# Altium project Funcgen.PrjPcb
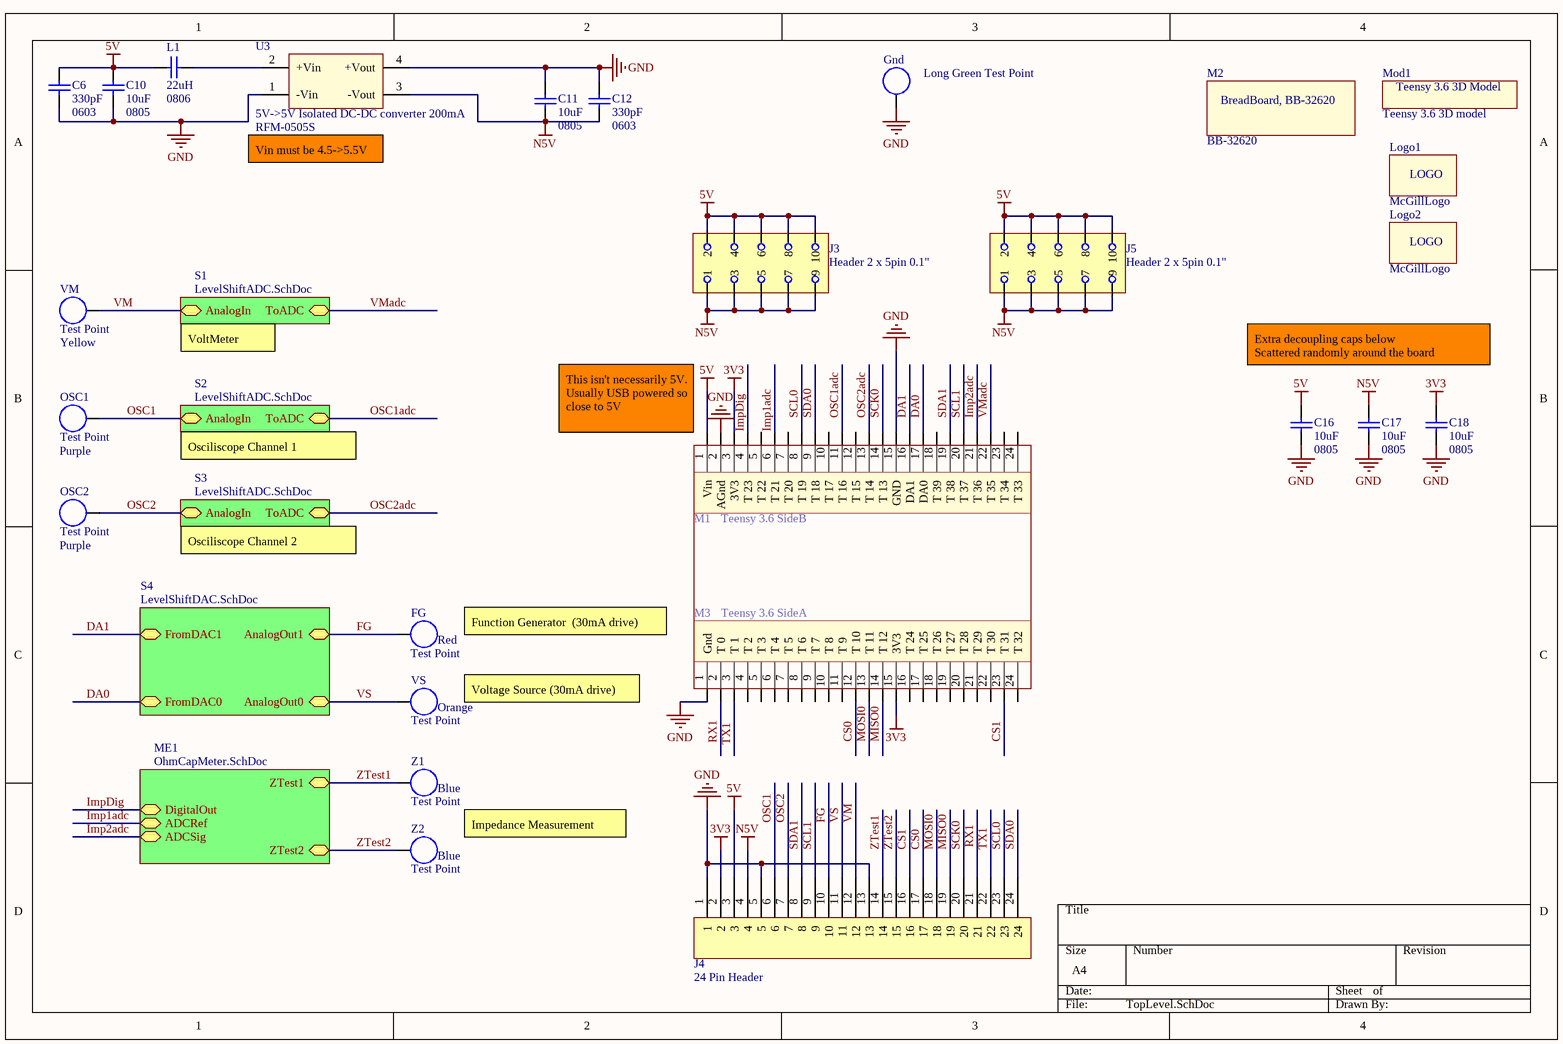
[diagram p0: TopLevel.SchDoc]
4 sheets, 84 parts. Net scope: hierarchical (ports join the sheet entries above them; power ports are global).
Board file: FuncGen.PcbDoc
Sheets:
  TopLevel.SchDoc
    S1 = LevelShiftADC.SchDoc
    S4 = LevelShiftDAC.SchDoc
    S2 = LevelShiftADC.SchDoc
    S3 = LevelShiftADC.SchDoc
    ME1 = OhmCapMeter.SchDoc

## Sheet TopLevel.SchDoc
size A4

### Parts
C6  330pF  [0603]
C10  10uF  [0805]
C11  10uF  [0805]
C12  330pF  [0603]
C16  10uF  [0805]
C17  10uF  [0805]
C18  10uF  [0805]
FG  Test Point  Param: Red  [TestPoint]
Gnd  Long Green Test Point  [TestPoint]
J3  Header 2 x 5pin 0.1"  [Header2x5]
J4  24 Pin Header  [Header24Male]
J5  Header 2 x 5pin 0.1"  [Header2x5]
L1  22uH  [0806]
Logo1  McGillLogo  [McGillLogo1]  (no BOM)
Logo2  McGillLogo  [McGillLogo1]  (no BOM)
M1  Teensy 3.6 SideB  [Header24Female]
M2  BB-32620  (mechanical)
M3  Teensy 3.6 SideA  [Header24Female]
Mod1  Teensy 3.6 3D model  [Teensy3.6 Model No pins]  (no BOM)
OSC1  Test Point  Param: Purple  [TestPoint]
OSC2  Test Point  Param: Purple  [TestPoint]
U3  RFM-0505S  [RFM-0505S]
VM  Test Point  Param: Yellow  [TestPoint]
VS  Test Point  Param: Orange  [TestPoint]
Z1  Test Point  Param: Blue  [TestPoint]
Z2  Test Point  Param: Blue  [TestPoint]

### Sub-sheets
ME1 = OhmCapMeter.SchDoc: DigitalOut, ADCRef, ADCSig, ZTest2, ZTest1
S1 = LevelShiftADC.SchDoc: AnalogIn, ToADC
S2 = LevelShiftADC.SchDoc: AnalogIn, ToADC
S3 = LevelShiftADC.SchDoc: AnalogIn, ToADC
S4 = LevelShiftDAC.SchDoc: FromDAC1, FromDAC0, AnalogOut1, AnalogOut0

### Nets
3V3: C18.2 J4.2 M1.3(3V3) M3.15(3V3)
5V: C6.1 C10.2 C16.2 J3.2 J3.4 J3.6 J3.8 J3.10 J4.3 J5.2 J5.4 J5.6 J5.8 J5.10 L1.1 M1.1(Vin)
GND: C6.2 C10.1 C11.2 C12.1 C16.1 C17.1 C18.1 Gnd.0 J4.1 J4.5 J4.13 M1.2(AGnd) M1.15(GND) M3.1(Gnd) U3.1(-Vin) U3.4(+Vout)
N5V: C11.1 C12.2 C17.2 J3.1 J3.3 J3.5 J3.7 J3.9 J4.4 J5.1 J5.3 J5.5 J5.7 J5.9 U3.3(-Vout)
CS0: J4.17 M3.12(T_10)
CS1: J4.16 M3.23(T_31)
DA0: M1.17(DA0) ; sheet S4/FromDAC0
DA1: M1.16(DA1) ; sheet S4/FromDAC1
FG: FG.0 J4.10 ; sheet S4/AnalogOut1
Imp1adc: J4.14 M1.6(T_21) Z1.0 ; sheet ME1/ADCRef, sheet ME1/ZTest1  [also labelled ZTest1]
Imp2adc: M1.21(T_36) ; sheet ME1/ADCSig
ImpDig: M1.4(T_23) ; sheet ME1/DigitalOut
MISO0: J4.19 M3.14(T_12)
MOSI0: J4.18 M3.13(T_11)
OSC1: J4.6 OSC1.0 ; sheet S2/AnalogIn
OSC1adc: M1.11(T_16) ; sheet S2/ToADC
OSC2: J4.7 OSC2.0 ; sheet S3/AnalogIn
OSC2adc: M1.13(T_14) ; sheet S3/ToADC
RX1: J4.21 M3.2(T_0)
SCK0: J4.20 M1.14(T_13)
SCL0: J4.23 M1.8(T_19)
SCL1: J4.9 M1.20(T_37)
SDA0: J4.24 M1.9(T_18)
SDA1: J4.8 M1.19(T_38)
TX1: J4.22 M3.3(T_1)
VM: J4.12 VM.0 ; sheet S1/AnalogIn
VMadc: M1.22(T_35) ; sheet S1/ToADC
VS: J4.11 VS.0 ; sheet S4/AnalogOut0
ZTest2: J4.15 Z2.0 ; sheet ME1/ZTest2
NetL1_2: L1.2 U3.2(+Vin)

Not connected (* = marked no-connect by the designer): M1 5(T_22) 7(T_20) 10(T_17) 12(T_15) 18(T_39) 23(T_34) 24(T_33); M3 4(T_2) 5(T_3) 6(T_4) 7(T_5) 8(T_6) 9(T_7) 10(T_8) 11(T_9) 16(T_24) 17(T_25) 18(T_26) 19(T_27) 20(T_28) 21(T_29) 22(T_30) 24(T_32)

### Notes on the sheet
- (near U3) Vin must be 4.5->5.5V
- VoltMeter
- Extra decoupling caps below
  Scattered randomly around the board
- Osciliscope Channel 1
- (near M1) This isn't necessarily 5V. Usually USB powered so close to 5V
- Osciliscope Channel 2
- Function Generator  (30mA drive)
- Voltage Source (30mA drive)
- Impedance Measurement
- (in symbol BreadBoard) BreadBoard, BB-32620
- (in symbol Logo) LOGO
- (in symbol RFM-0505S) 5V->5V Isolated DC-DC converter 200mA
- (in symbol Teensy 3.6 3D model) Teensy 3.6 3D Model

### Library data of the parts
C6 C12 = Cap0603: Capacitor, Ceramic, 0603; Manufacturer: Yageo; Manufacturers Part Number: CC0603KRX7R9BB331; Assembly Comments: none; Loaded: True; Value: 330pF, 50V; TechInf: *; Param1: *; Part constraints: CC0603KRX7R9BB331; Supplier 1: Digi-Key; Supplier Part Number 1: 311-1186-1-ND; SupplierUnitCost: $0.0449
C10 C11 C16-C18 = Cap0805: 0805; Manufacturer: Taiyo Yuden; Part constraints: EMK212BJ106KG-T; Assembly Comments: none; Loaded: True; Value: 10uF 16V; Manufacturers Part Number: EMK212BJ106KG-T; Supplier 1: Digi-Key; Supplier Part Number 1: 587-1295-1-ND; SupplierUnitCost: $0.078
FG = TestPoint: Manufacturer: Keystone Electronics; Part Constraints: 5005; Assembly Comments: none; Loaded: True; Manufacturers Part Number: Red - 5005; Supplier 1: Digi-Key; Supplier Part Number 1: 36-5005-ND; SupplierUnitCost: $0.15
Gnd = TestPoint: Test Point; Manufacturer: Keystone Electronics; Part Constraints: 5126; Assembly Comments: none; Loaded: True; Manufacturers Part Number: Green - 5126; Param: Green; Supplier 1: Digi-Key; Supplier Part Number 1: 36-5126-ND; SupplierUnitCost: $0.15
J3 J5 = Header2x5: Header, 0.1", 2 row 5 pins; Manufacturer: Wurth Electronics Inc.; Manufacturers Part Number: 61301021121; Assembly Comments: none; Loaded: True; Footprint: *; Part constraints: 61301021121; Supplier 1: Digi-Key; Supplier Part Number 1: 732-2672-ND; SupplierUnitCost: $1.11012
J4 = 24 Pin Header: Manufacturer: Wurth Electronics Inc.; Manufacturers Part Number: 61302411121; Assembly Comments: none; Loaded: True; Part Constraints: 61302411121; Supplier 1: Digi-Key; Supplier Part Number 1: 732-5331-ND; SupplierUnitCost: $0.93
L1 = CBC2016T220M: 0805; Manufacturer: Taiyo Yuden; Assembly Comments: none; Loaded: True; Value: 22uH, 240mA, 2.3 Ohm; Part constraints: CBC2016T220M; Manufacturers Part Number: CBC2016T220M; Supplier 1: Digi-Key; Supplier Part Number 1: 587-1609-1-ND; SupplierUnitCost: $0.23
Logo1 Logo2 = Logo
M1 = Teensy 3.6 SideB: Teensy 3.6 SideA; Manufacturer: Sullins Connector Solutions; Manufacturers Part Number: PPPC241LFBN-RC; Assembly Comments: none; Loaded: True; Part constraints: PPPC241LFBN-RC; Supplier 1: Digi-Key; Supplier Part Number 1: S7057-ND; SupplierUnitCost: $1.57
M2 = BreadBoard: Breadboard BB-32620; Manufacturer: Bud Industries; Assembly Comments: none; Loaded: True; Manufacturers Part Number: BB-32620; Part constraints: BB-32620; Supplier 1: Digi-Key; Supplier Part Number 1: 377-2091-ND; SupplierUnitCost: $9.499
M3 = Teensy 3.6 SideA: Manufacturer: Sullins Connector Solutions; Manufacturers Part Number: PPPC241LFBN-RC; Assembly Comments: none; Loaded: True; Part constraints: PPPC241LFBN-RC; Supplier 1: Digi-Key; Supplier Part Number 1: S7057-ND; SupplierUnitCost: $1.57
Mod1 = Teensy 3.6 3D model: Manufacturer: SparkFun Electronics; Manufacturers Part Number: DEV-14058; Assembly Comments: none; Loaded: True; Part Constraints: DEV-14058; Supplier 1: Digi-Key; Supplier Part Number 1: 1568-1465-ND; SupplierUnitCost: $55.61
OSC1 OSC2 = TestPoint: Manufacturer: Keystone Electronics; Part Constraints: 5124; Assembly Comments: none; Loaded: True; Manufacturers Part Number: Purple - 5124; Supplier 1: Digi-Key; Supplier Part Number 1: 36-5124-ND; SupplierUnitCost: $0.15
U3 = RFM-0505S: 5V->5V DC-DC converter; Manufacturer: Recom Power; Assembly Comments: none; Loaded: True; Manufacturers Part Number: RFM-0505S; Supplier 1: Digi-Key; Supplier Part Number 1: 945-3159-ND; SupplierUnitCost: $1.24; Part constraints: RFM-0505S
VM = TestPoint: Manufacturer: Keystone Electronics; Part Constraints: 5009; Assembly Comments: none; Loaded: True; Manufacturers Part Number: Yellow - 5009; Supplier 1: Digi-Key; Supplier Part Number 1: 36-5009-ND; SupplierUnitCost: $0.15
VS = TestPoint: Manufacturer: Keystone Electronics; Part Constraints: 5008; Assembly Comments: none; Loaded: True; Manufacturers Part Number: Orange - 5008; Supplier 1: Digi-Key; Supplier Part Number 1: 36-5008-ND; SupplierUnitCost: $0.15
Z1 Z2 = TestPoint: Manufacturer: Keystone Electronics; Part Constraints: 5122; Assembly Comments: none; Loaded: True; Manufacturers Part Number: Blue - 5122; Supplier 1: Digi-Key; Supplier Part Number 1: 36-5122-ND; SupplierUnitCost: $0.15

## Sheet LevelShiftADC.SchDoc
size A4
Used 3 times, as channels S1, S2, S3. Parts and nets are listed once, with the designators drawn on the sheet.
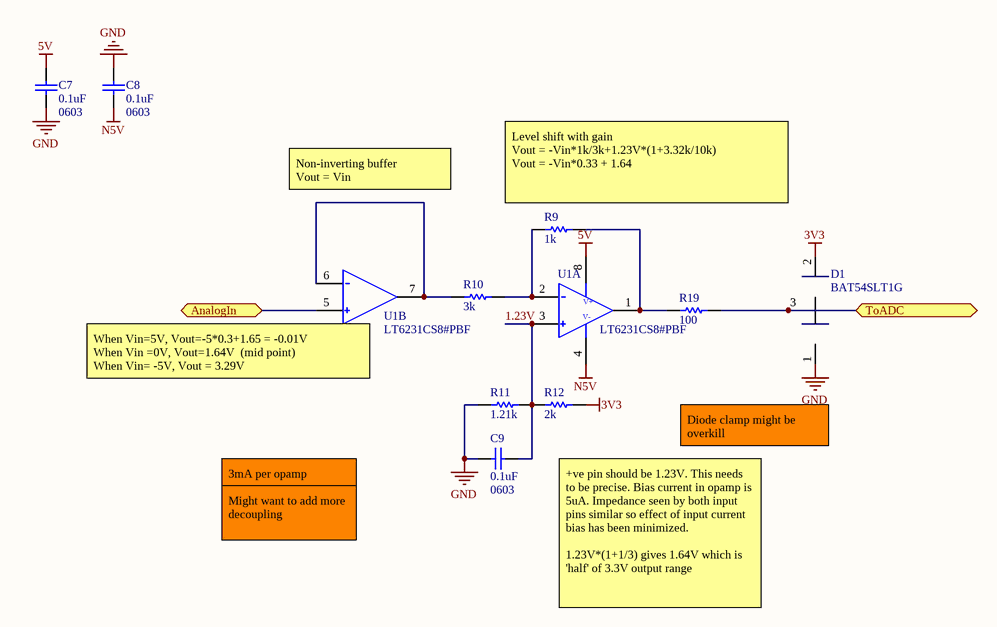
[diagram p1: LevelShiftADC.SchDoc]

### Parts
C7  0.1uF  [0603]
C8  0.1uF  [0603]
C9  0.1uF  [0603]
D1  BAT54SLT1G  [SOT23]
R9  value 1k  [0603]  (hidden comment: Res0603)
R10  value 3k  [0603]  (hidden comment: Res0603)
R11  value 1.21k  [0603]  (hidden comment: Res0603)
R12  value 2k  [0603]  (hidden comment: Res0603)
R19  value 100  [0603]  (hidden comment: Res0603)
U1  LT6231CS8#PBF  [SO8]  (parts A,B of 2)

### Ports
AnalogIn, ToADC

### Nets
3V3: D1.2 R12.2
5V: C7.2 U1.8(V+)
GND: C7.1 C8.2 C9.1 D1.1 R11.1
N5V: C8.1 U1.4(V-)
1.23V: C9.2 R11.2 R12.1 U1.3(IN+)
AnalogIn: U1.5(IN+) ; port AnalogIn
ToADC: D1.3 R19.2 ; port ToADC
NetR9_1: R9.1 R10.2 U1.2(IN-)
NetR9_2: R9.2 R19.1 U1.1(Out)
NetR10_1: R10.1 U1.6(IN-) U1.7(Out)

### Channels
S1: designators end in _S1; ports AnalogIn=VM ToADC=VMadc
S2: designators end in _S2; ports AnalogIn=OSC1 ToADC=OSC1adc
S3: designators end in _S3; ports AnalogIn=OSC2 ToADC=OSC2adc

### Notes on the sheet
- Non-inverting buffer
  Vout = Vin
- (near R9) Level shift with gain
  Vout = -Vin*1k/3k+1.23V*(1+3.32k/10k)
  Vout = -Vin*0.33 + 1.64
- (near U1) When Vin=5V, Vout=-5*0.3+1.65 = -0.01V
  When Vin =0V, Vout=1.64V  (mid point)
  When Vin= -5V, Vout = 3.29V
- Diode clamp might be overkill
- 3mA per opamp
- Might want to add more decoupling
- +ve pin should be 1.23V. This needs to be precise. Bias current in opamp is 5uA. Impedance seen by both input pins similar so effect of input current bias has been minimized.
  1.23V*(1+1/3) gives 1.64V which is 'half' of 3.3V output range

### Library data of the parts
C7-C9 = Cap0603: Capacitor, Ceramic, 0603; Manufacturer: Samsung Electro-Mechanics; Manufacturers Part Number: CL10A104KA8NNNC; Assembly Comments: none; Loaded: True; Value: 0.1uF 25V; TechInf: *; Param1: *; Part constraints: CL10A104KA8NNNC; Supplier 1: Digi-Key; Supplier Part Number 1: 1276-1857-1-ND; SupplierUnitCost: $0.02092
D1 = DiodeClamp: Manufacturer: ON Semiconductor; Assembly Comments: none; Loaded: True; Manufacturers Part Number: BAT54SLT1G; Part constraints: BAT54SLT1G; Supplier 1: Digi-Key; Supplier Part Number 1: BAT54SLT1GOSCT-ND; SupplierUnitCost: $0.132
R9 = Res0603: Resistor; Manufacturer: Yageo; Manufacturers Part Number: RC0603FR-071KL; Assembly Comments: none; Loaded: True; TechInfo: *; Part constraints: RC0603FR-071KL; Supplier 1: Digi-Key; Supplier Part Number 1: 311-1.00KHRCT-ND; SupplierUnitCost: $0.016
R10 = Res0603: Resistor; Manufacturer: Vishay Dale; Manufacturers Part Number: CRCW06033K00FKEAC; Assembly Comments: none; Loaded: True; TechInfo: *; Part constraints: CRCW06033K00FKEAC; Supplier 1: Digi-Key; Supplier Part Number 1: 541-4040-1-ND; SupplierUnitCost: $0.018
R11 = Res0603: Resistor; Manufacturer: Yageo; Manufacturers Part Number: RMCF0603FT1K21; Assembly Comments: none; Loaded: True; TechInfo: *; Part constraints: RMCF0603FT1K21; Supplier 1: Digi-Key; Supplier Part Number 1: RMCF0603FT1K21CT-ND; SupplierUnitCost: $0.0107
R12 = Res0603: Resistor; Manufacturer: Vishay Dale; Manufacturers Part Number: CRCW06032K00FKEAC; Assembly Comments: none; Loaded: True; TechInfo: *; Part constraints: CRCW06032K00FKEAC; Supplier 1: Digi-Key; Supplier Part Number 1: 541-3953-1-ND; SupplierUnitCost: $0.01180
R19 = Res0603: Resistor; Manufacturer: Yageo; Manufacturers Part Number: RC0603FR-07100RL; Assembly Comments: none; Loaded: True; TechInfo: *; Part constraints: RC0603FR-07100RL; Supplier 1: Digi-Key; Supplier Part Number 1: 311-100HRCT-ND; SupplierUnitCost: $0.016
U1 = TSH82IYDT: Dual R-R Opamp Soic 8 215Mhz GBP; Manufacturer: Linear Technology/Analog Devices; Assembly Comments: none; Loaded: True; Supplier 1: Digi-Key; Supplier Part Number 1: LT6231CS8#PBF-ND; Part Constraints: LT6231CS8; Manufacturers Part Number: LT6231CS8; SupplierUnitCost: $3.5

## Sheet LevelShiftDAC.SchDoc
size A4
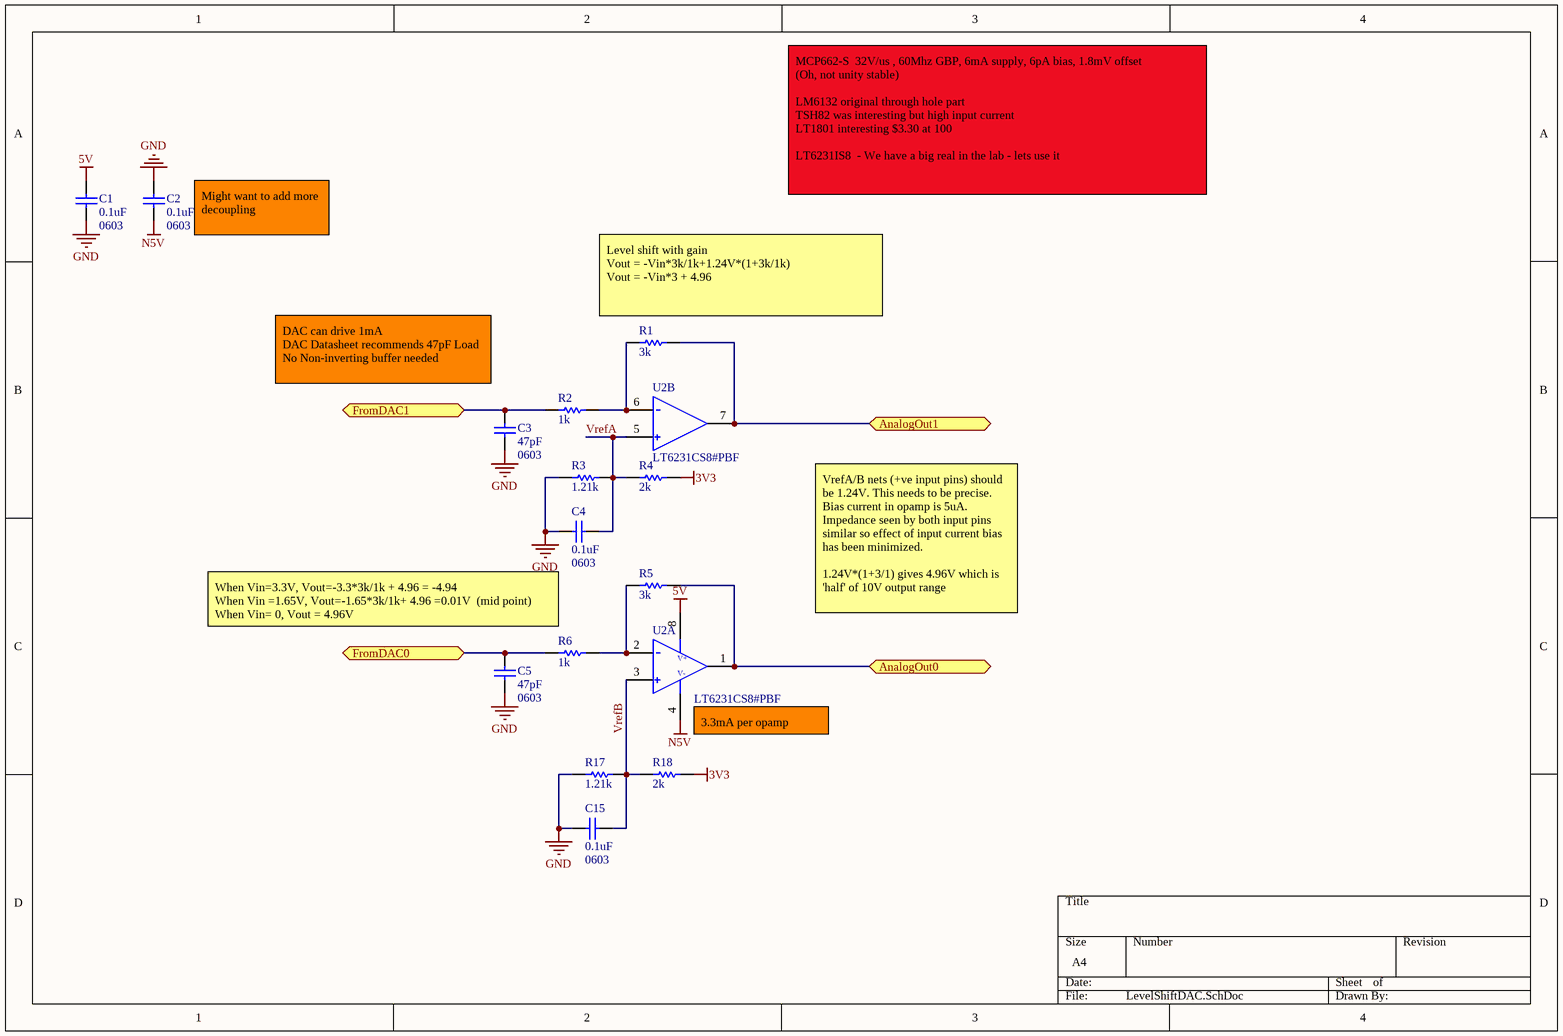
[diagram p2: LevelShiftDAC.SchDoc]

### Parts
C1  0.1uF  [0603]
C2  0.1uF  [0603]
C3  47pF  [0603]
C4  0.1uF  [0603]
C5  47pF  [0603]
C15  0.1uF  [0603]
R1  value 3k  [0603]  (hidden comment: Res0603)
R2  value 1k  [0603]  (hidden comment: Res0603)
R3  value 1.21k  [0603]  (hidden comment: Res0603)
R4  value 2k  [0603]  (hidden comment: Res0603)
R5  value 3k  [0603]  (hidden comment: Res0603)
R6  value 1k  [0603]  (hidden comment: Res0603)
R17  value 1.21k  [0603]  (hidden comment: Res0603)
R18  value 2k  [0603]  (hidden comment: Res0603)
U2  LT6231CS8#PBF  [SO8]  (parts A,B of 2)

### Ports
AnalogOut0, AnalogOut1, FromDAC0, FromDAC1

### Nets
3V3: R4.2 R18.2
5V: C1.2 U2.8(V+)
GND: C1.1 C2.2 C3.1 C4.1 C5.1 C15.1 R3.1 R17.1
N5V: C2.1 U2.4(V-)
DA0: C5.2 R6.1 ; port FromDAC0
DA1: C3.2 R2.1 ; port FromDAC1
FG: R1.2 U2.7(Out) ; port AnalogOut1
VrefA: C4.2 R3.2 R4.1 U2.5(IN+)
VrefB: C15.2 R17.2 R18.1 U2.3(IN+)
VS: R5.2 U2.1(Out) ; port AnalogOut0
NetR1_1: R1.1 R2.2 U2.6(IN-)
NetR5_1: R5.1 R6.2 U2.2(IN-)

### Notes on the sheet
- (near C2) Might want to add more decoupling
- MCP662-S  32V/us , 60Mhz GBP, 6mA supply, 6pA bias, 1.8mV offset
  (Oh, not unity stable)
  LM6132 original through hole part
  TSH82 was interesting but high input current
  LT1801 interesting $3.30 at 100
  LT6231IS8  - We have a big real in the lab - lets use it
- (near R1) Level shift with gain
  Vout = -Vin*3k/1k+1.24V*(1+3k/1k)
  Vout = -Vin*3 + 4.96
- (near C3) DAC can drive 1mA
  DAC Datasheet recommends 47pF Load
  No Non-inverting buffer needed
- When Vin=3.3V, Vout=-3.3*3k/1k + 4.96 = -4.94
  When Vin =1.65V, Vout=-1.65*3k/1k+ 4.96 =0.01V  (mid point)
  When Vin= 0, Vout = 4.96V
- VrefA/B nets (+ve input pins) should be 1.24V. This needs to be precise. Bias current in opamp is 5uA. Impedance seen by both input pins similar so effect of input current bias has been minimized.
  1.24V*(1+3/1) gives 4.96V which is 'half' of 10V output range
- (near U2) 3.3mA per opamp

### Library data of the parts
C1 C2 C4 C15 = Cap0603: as C7 on sheet LevelShiftADC; TechInf: *; Param1: *; Part constraints: CL10A104KA8NNNC; Supplier 1: Digi-Key; Supplier Part Number 1: 1276-1857-1-ND; SupplierUnitCost: $0.02092
C3 C5 = Cap0603: Capacitor, Ceramic, 0603; Manufacturer: Wurth Electronics Inc.; Manufacturers Part Number: 885012006021; Assembly Comments: none; Loaded: True; Value: 47pF 16V; TechInf: *; Param1: *; Part constraints: 885012006021; Supplier 1: Digi-Key; Supplier Part Number 1: 732-7764-1-ND; SupplierUnitCost: $0.02990
R1 R5 = Res0603: as R10 on sheet LevelShiftADC; TechInfo: *; Part constraints: CRCW06033K00FKEAC; Supplier 1: Digi-Key; Supplier Part Number 1: 541-4040-1-ND; SupplierUnitCost: $0.018
R2 R6 = Res0603: as R9 on sheet LevelShiftADC; TechInfo: *; Part constraints: RC0603FR-071KL; Supplier 1: Digi-Key; Supplier Part Number 1: 311-1.00KHRCT-ND; SupplierUnitCost: $0.016
R3 R17 = Res0603: as R11 on sheet LevelShiftADC; TechInfo: *; Part constraints: RMCF0603FT1K21; Supplier 1: Digi-Key; Supplier Part Number 1: RMCF0603FT1K21CT-ND; SupplierUnitCost: $0.0107
R4 R18 = Res0603: as R12 on sheet LevelShiftADC; TechInfo: *; Part constraints: CRCW06032K00FKEAC; Supplier 1: Digi-Key; Supplier Part Number 1: 541-3953-1-ND; SupplierUnitCost: $0.01180
U2 = TSH82IYDT: as U1 on sheet LevelShiftADC; Supplier 1: Digi-Key; Supplier Part Number 1: LT6231CS8#PBF-ND; Part Constraints: LT6231CS8; Manufacturers Part Number: LT6231CS8; SupplierUnitCost: $3.5

## Sheet OhmCapMeter.SchDoc
size A4
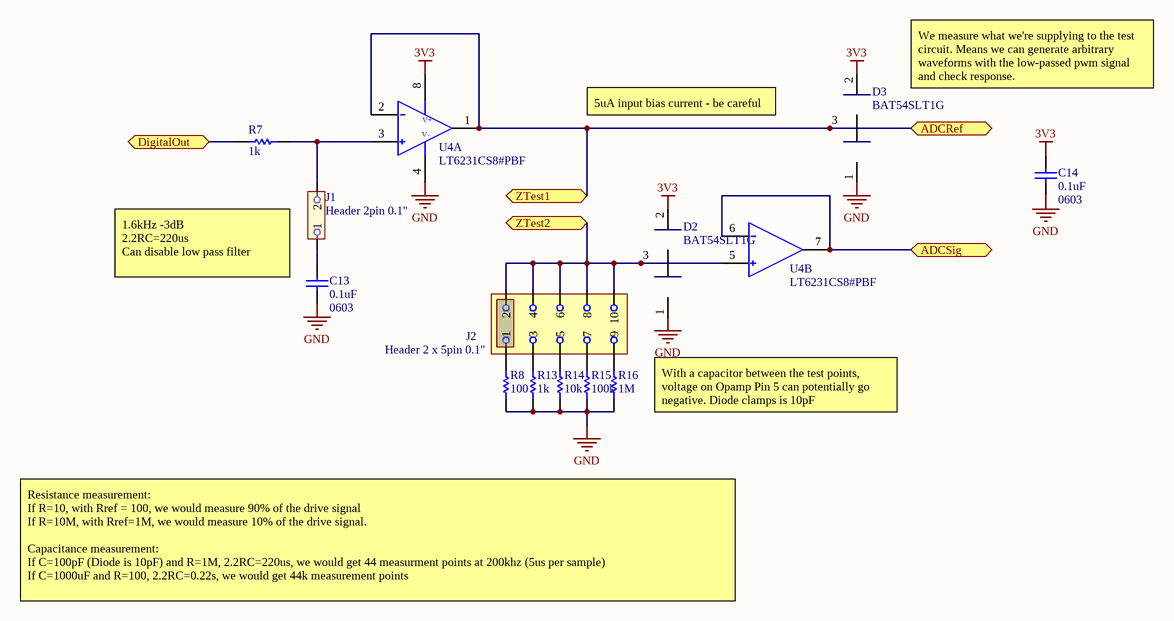
[diagram p3: OhmCapMeter.SchDoc]

### Parts
C13  0.1uF  [0603]
C14  0.1uF  [0603]
D2  BAT54SLT1G  [SOT23]
D3  BAT54SLT1G  [SOT23]
J1  Header 2pin 0.1"  [HDR1X2]
J2  Header 2 x 5pin 0.1"  [Header2x5]
R7  value 1k  [0603]  (hidden comment: Res0603)
R8  value 100  [0603]  (hidden comment: Res0603)
R13  value 1k  [0603]  (hidden comment: Res0603)
R14  value 10k  [0603]  (hidden comment: Res0603)
R15  value 100k  [0603]  (hidden comment: Res0603)
R16  value 1M  [0603]  (hidden comment: Res0603)
U4  LT6231CS8#PBF  [SO8]  (parts A,B of 2)

### Ports
ADCRef, ADCSig, DigitalOut, ZTest1, ZTest2

### Nets
3V3: C14.2 D2.2 D3.2 U4.8(V+)
GND: C13.1 C14.1 D2.1 D3.1 R8.1 R13.1 R14.1 R15.1 R16.1 U4.4(V-)
Imp1adc: D3.3 U4.1(Out) U4.2(IN-) ; port ADCRef, port ZTest1
Imp2adc: U4.6(IN-) U4.7(Out) ; port ADCSig
ImpDig: R7.2 ; port DigitalOut
ZTest2: D2.3 J2.2 J2.4 J2.6 J2.8 J2.10 U4.5(IN+) ; port ZTest2
NetC13_2: C13.2 J1.1
NetJ1_2: J1.2 R7.1 U4.3(IN+)
NetJ2_1: J2.1 R8.2
NetJ2_3: J2.3 R13.2
NetJ2_5: J2.5 R14.2
NetJ2_7: J2.7 R15.2
NetJ2_9: J2.9 R16.2

### Notes on the sheet
- We measure what we're supplying to the test circuit. Means we can generate arbitrary waveforms with the low-passed pwm signal and check response.
- 5uA input bias current - be careful
- 1.6kHz -3dB
  2.2RC=220us
  Can disable low pass filter
- With a capacitor between the test points, voltage on Opamp Pin 5 can potentially go negative. Diode clamps is 10pF
- Resistance measurement:
  If R=10, with Rref = 100, we would measure 90% of the drive signal
  If R=10M, with Rref=1M, we would measure 10% of the drive signal.
  Capacitance measurement:
  If C=100pF (Diode is 10pF) and R=1M, 2.2RC=220us, we would get 44 measurment points at 200khz (5us per sample)
  If C=1000uF and R=100, 2.2RC=0.22s, we would get 44k measurement points

### Library data of the parts
C13 C14 = Cap0603: as C7 on sheet LevelShiftADC; TechInf: *; Param1: *; Part constraints: CL10A104KA8NNNC; Supplier 1: Digi-Key; Supplier Part Number 1: 1276-1857-1-ND; SupplierUnitCost: $0.02092
D2 D3 = DiodeClamp: as D1 on sheet LevelShiftADC; Manufacturers Part Number: BAT54SLT1G; Part constraints: BAT54SLT1G; Supplier 1: Digi-Key; Supplier Part Number 1: BAT54SLT1GOSCT-ND; SupplierUnitCost: $0.132
J1 = Header2: Header, 0.1", 2-Pin straight (Any equivalent - may need to be value added); Manufacturer: Wurth Electronics Inc.; Manufacturers Part Number: 61300211121; Assembly Comments: none; Loaded: True; Footprint: *; Part constraints: 61300211121; Supplier 1: Digi-Key; Supplier Part Number 1: 732-5315-ND; SupplierUnitCost: $0.10480
J2 = Header2x5: as J3 on sheet TopLevel; Footprint: *; Part constraints: 61301021121; Supplier 1: Digi-Key; Supplier Part Number 1: 732-2672-ND; SupplierUnitCost: $1.11012
R7 R13 = Res0603: as R9 on sheet LevelShiftADC; TechInfo: *; Part constraints: RC0603FR-071KL; Supplier 1: Digi-Key; Supplier Part Number 1: 311-1.00KHRCT-ND; SupplierUnitCost: $0.016
R8 = Res0603: as R19 on sheet LevelShiftADC; TechInfo: *; Part constraints: RC0603FR-07100RL; Supplier 1: Digi-Key; Supplier Part Number 1: 311-100HRCT-ND; SupplierUnitCost: $0.016
R14 = Res0603: Resistor; Manufacturer: Yageo; Manufacturers Part Number: RC0603FR-0710KL; Assembly Comments: none; Loaded: True; TechInfo: *; Part constraints: RC0603FR-0710KL; Supplier 1: Digi-Key; Supplier Part Number 1: 311-10.0KHRCT-ND; SupplierUnitCost: $0.016
R15 = Res0603: Resistor; Manufacturer: Yageo; Manufacturers Part Number: AC0603FR-07100KL; Assembly Comments: none; Loaded: True; TechInfo: *; Part constraints: AC0603FR-07100KL; Supplier 1: Digi-Key; Supplier Part Number 1: 311-100KLDCT-ND; SupplierUnitCost: $0.019
R16 = Res0603: Resistor; Manufacturer: Yageo; Manufacturers Part Number: AC0603FR-071ML; Assembly Comments: none; Loaded: True; TechInfo: *; Part constraints: AC0603FR-071ML; Supplier 1: Digi-Key; Supplier Part Number 1: 311-1MLDCT-ND; SupplierUnitCost: $0.019
U4 = TSH82IYDT: Dual R-R Opamp Soic 8 70Mhz GBP; Manufacturer: Linear Technology/Analog Devices; Assembly Comments: none; Loaded: True; Supplier 1: Digi-Key; Supplier Part Number 1: LT6231CS8#PBF-ND; Part Constraints: LT6231CS8; Manufacturers Part Number: LT6231CS8; SupplierUnitCost: $3.5

## Nets that join several sheets
3V3: TopLevel (C18.2 J4.2 M1.3 M3.15), S1 (D1_S1.2 R12_S1.2), LevelShiftDAC (R4.2 R18.2), S2 (D1_S2.2 R12_S2.2), S3 (D1_S3.2 R12_S3.2), OhmCapMeter (C14.2 D2.2 D3.2 U4.8)
5V: TopLevel (16 pins), S1 (C7_S1.2 U1_S1.8), LevelShiftDAC (C1.2 U2.8), S2 (C7_S2.2 U1_S2.8), S3 (C7_S3.2 U1_S3.8)
GND: TopLevel (16 pins), S1 (5 pins), LevelShiftDAC (8 pins), S2 (5 pins), S3 (5 pins), OhmCapMeter (10 pins)
N5V: TopLevel (15 pins), S1 (C8_S1.1 U1_S1.4), LevelShiftDAC (C2.1 U2.4), S2 (C8_S2.1 U1_S2.4), S3 (C8_S3.1 U1_S3.4)
DA0: TopLevel (M1.17), LevelShiftDAC (C5.2 R6.1)
DA1: TopLevel (M1.16), LevelShiftDAC (C3.2 R2.1)
FG: TopLevel (FG.0 J4.10), LevelShiftDAC (R1.2 U2.7)
Imp1adc: TopLevel (J4.14 M1.6 Z1.0), OhmCapMeter (D3.3 U4.1 U4.2)
Imp2adc: TopLevel (M1.21), OhmCapMeter (U4.6 U4.7)
ImpDig: TopLevel (M1.4), OhmCapMeter (R7.2)
OSC1: TopLevel (J4.6 OSC1.0), S2 (U1_S2.5)
OSC1adc: TopLevel (M1.11), S2 (D1_S2.3 R19_S2.2)
OSC2: TopLevel (J4.7 OSC2.0), S3 (U1_S3.5)
OSC2adc: TopLevel (M1.13), S3 (D1_S3.3 R19_S3.2)
VM: TopLevel (J4.12 VM.0), S1 (U1_S1.5)
VMadc: TopLevel (M1.22), S1 (D1_S1.3 R19_S1.2)
VS: TopLevel (J4.11 VS.0), LevelShiftDAC (R5.2 U2.1)
ZTest2: TopLevel (J4.15 Z2.0), OhmCapMeter (7 pins)